# Altium project Newracom-WiWi.PrjPcb (part 3 of 3)

## Sheet POWER.SchDoc: POWER
size B; SheetNumber: 7; SheetTotal: 9
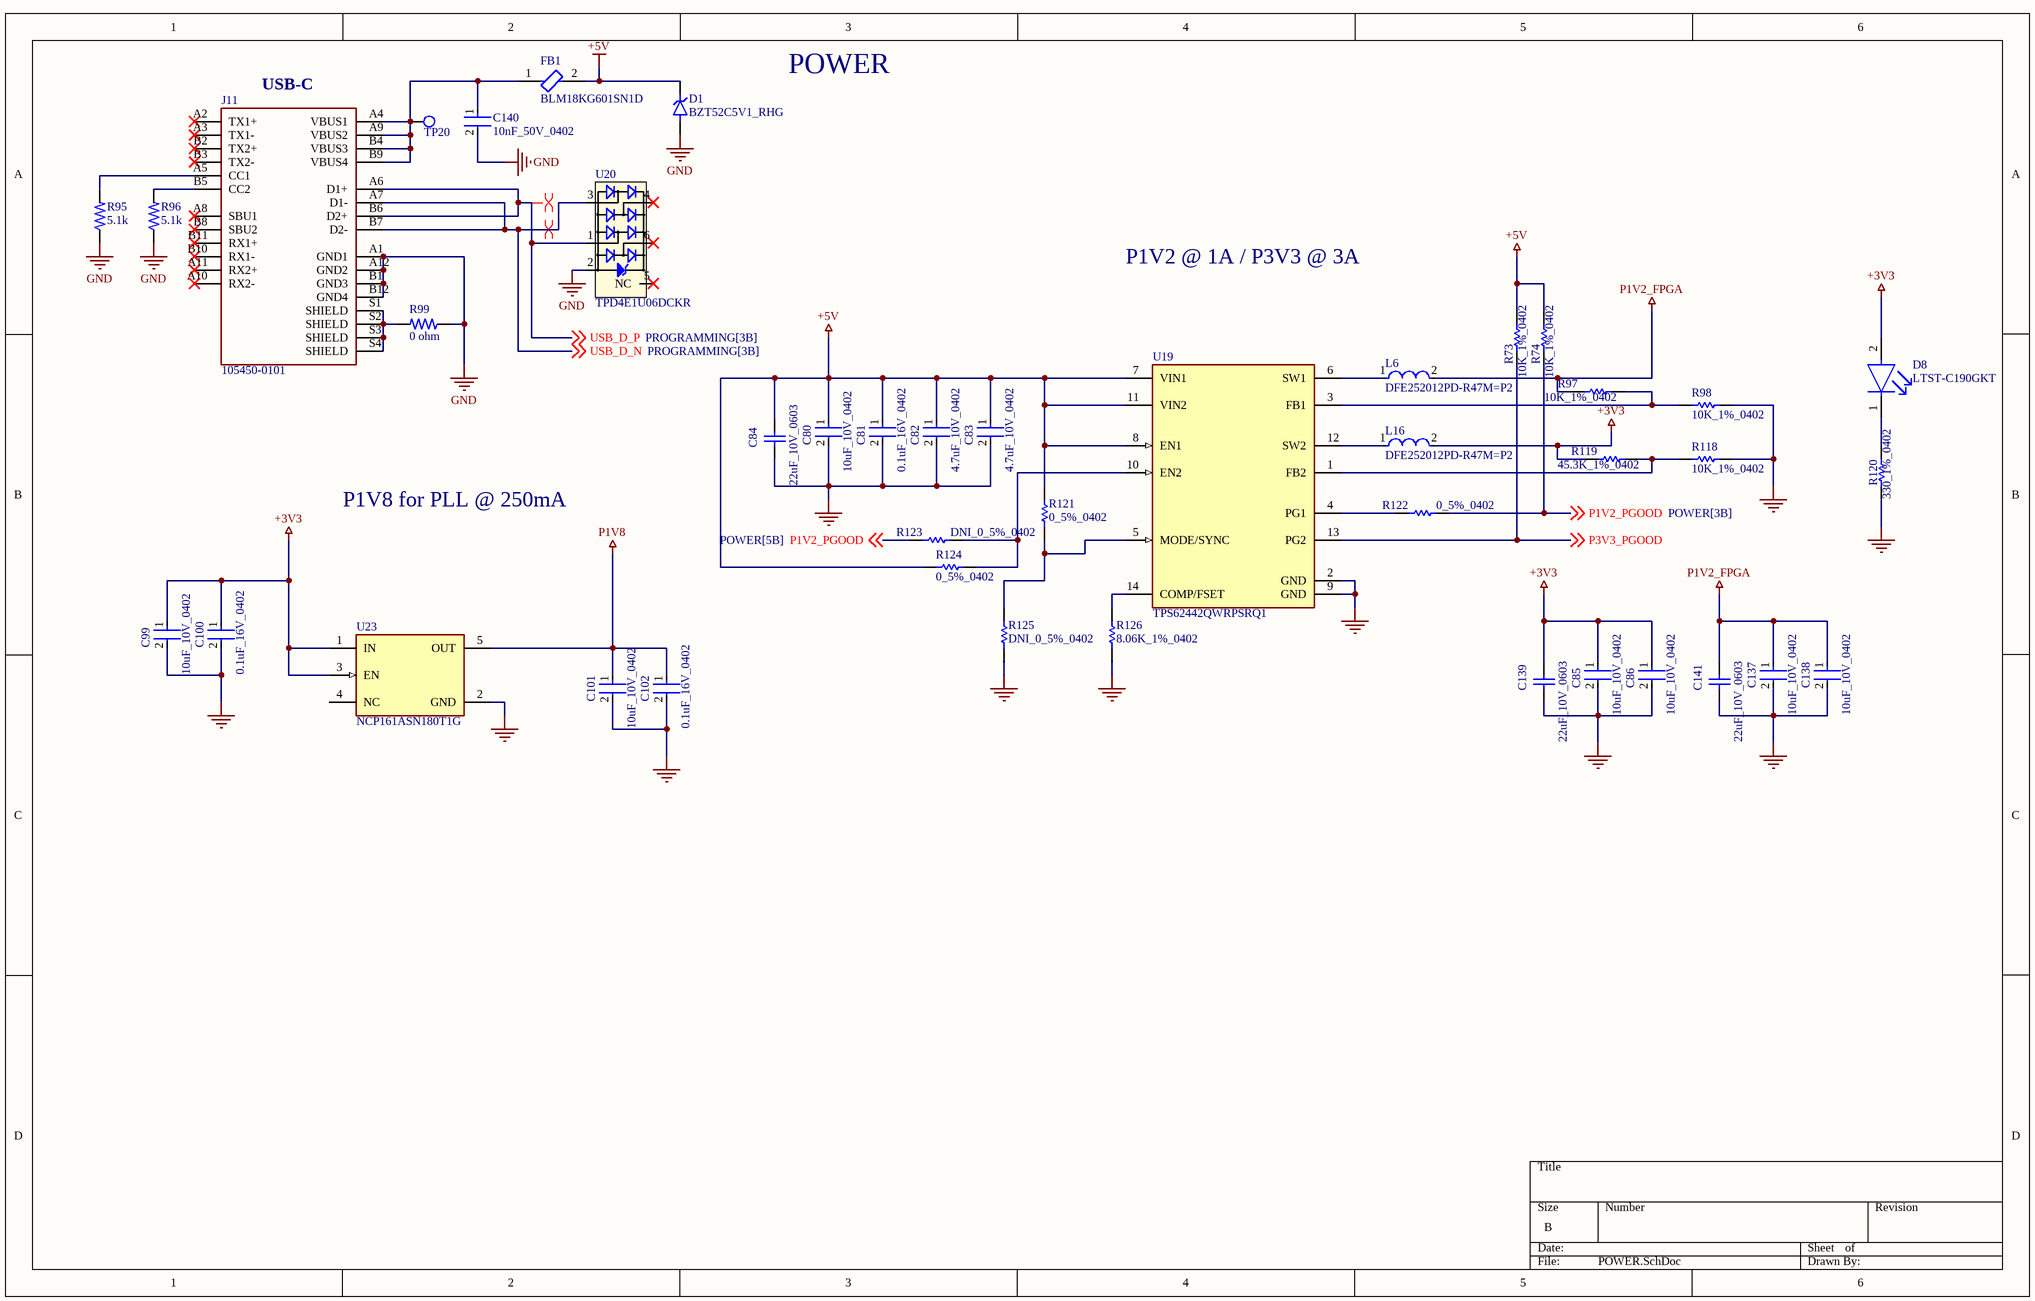
[diagram p7: POWER.SchDoc]

### Parts
C80  10uF_10V_0402  [FP-CL05A106MP5NUNC-MFG]
C81  0.1uF_16V_0402  [FP-C0402-BB-MFG]
C82  4.7uF_10V_0402  [FP-C1005-050-0_15-MFG]
C83  4.7uF_10V_0402  [FP-C1005-050-0_15-MFG]
C84  22uF_10V_0603  [CAPC1608X100X20ML10]
C85  10uF_10V_0402  [FP-CL05A106MP5NUNC-MFG]
C86  10uF_10V_0402  [FP-CL05A106MP5NUNC-MFG]
C99  10uF_10V_0402  [FP-CL05A106MP5NUNC-MFG]
C100  0.1uF_16V_0402  [FP-C0402-BB-MFG]
C101  10uF_10V_0402  [FP-CL05A106MP5NUNC-MFG]
C102  0.1uF_16V_0402  [FP-C0402-BB-MFG]
C137  10uF_10V_0402  [FP-CL05A106MP5NUNC-MFG]
C138  10uF_10V_0402  [FP-CL05A106MP5NUNC-MFG]
C139  22uF_10V_0603  [CAPC1608X100X20ML10]
C140  10nF_50V_0402  [FP-CL165-IPC_C]
C141  22uF_10V_0603  [CAPC1608X100X20ML10]
D1  BZT52C5V1_RHG  [D_BZT52C5V1_RHG]
D8  LTST-C190GKT  [FP-LTST-C190GKT-MFG]
FB1  BLM18KG601SN1D  [FP-BLM18-0_15-t0_8-IPC_A]
J11  105450-0101  [CONN_105450-0101]
L6  DFE252012PD-R47M=P2  [FP-DFE252012C-IPC_A]
L16  DFE252012PD-R47M=P2  [FP-DFE252012C-IPC_A]
R73  10K_1%_0402  [RESC1005X40X25NL10T10]
R74  10K_1%_0402  [RESC1005X40X25NL10T10]
R95  5.1k  [RES_0402]
R96  5.1k  [RES_0402]
R97  10K_1%_0402  [RESC1005X40X25NL10T10]
R98  10K_1%_0402  [RESC1005X40X25NL10T10]
R99  0 ohm  [RES_0402]
R118  10K_1%_0402  [RESC1005X40X25NL10T10]
R119  45.3K_1%_0402  [RESC0402(1005)_L]
R120  330_1%_0402  [RESC1005X40X25NL10T10]
R121  0_5%_0402  [RESC1005X40X25NL05T10]
R122  0_5%_0402  [RESC1005X40X25NL05T10]
R123  DNI_0_5%_0402  [RESC1005X40X25NL05T10]  (no BOM)
R124  0_5%_0402  [RESC1005X40X25NL05T10]
R125  DNI_0_5%_0402  [RESC1005X40X25NL05T10]  (no BOM)
R126  8.06K_1%_0402  [RESC1005X40X25ML05T05]
TP20  Test Point 1MM  [TP_PAD-1MM]  (value not drawn)  (no BOM)
U19  TPS62442QWRPSRQ1  [FP-RQR0014A-MFG]
U20  TPD4E1U06DCKR  [IC_TPD4E1U06DCKR]
U23  NCP161ASN180T1G  [FP-527AH-MFG]

### Nets
+3V3: C85.1 C86.1 C99.1 C100.1 C139.2 D8.2(A) L16.2 R119.1 U23.1(IN) U23.3(EN)
+5V: C80.1 C81.1 C82.1 C83.1 C84.2 D1.C(K) FB1.2 R73.2 R74.2 R121.2 R124.2 U19.7(VIN1) U19.8(EN1) U19.11(VIN2)
GND: C80.2 C81.2 C82.2 C83.2 C84.1 C85.2 C86.2 C99.2 C100.2 C101.2 C102.2 C137.2 C138.2 C139.1 C140.2 C141.1 D1.A J11.A1(GND1) J11.A12(GND2) J11.B1(GND3) J11.B12(GND4) R95.1 R96.1 R98.1 R99.1 R118.1 R120.1 R125.1 R126.1 U19.2(GND) U19.9(GND) U20.2(GND) U23.2(GND)
P1V2_FPGA: C137.1 C138.1 C141.2 L6.2 R97.2
P1V8: C101.1 C102.1 U23.5(OUT)
P1V2_PGOOD: R74.1 R122.2 R123.1 ; off-sheet P1V2_PGOOD
P3V3_PGOOD: R73.1 U19.13(PG2) ; off-sheet P3V3_PGOOD
USB_D_N: J11.A7(D1-) J11.B7(D2-) U20.3(D+) ; off-sheet USB_D_N
USB_D_P: J11.A6(D1+) J11.B6(D2+) U20.1(D+) ; off-sheet USB_D_P
NetC140_1: C140.1 FB1.1 J11.A4(VBUS1) J11.A9(VBUS2) J11.B4(VBUS3) J11.B9(VBUS4) TP20.1
NetD8_1: D8.1(C) R120.2
NetJ11_A5: J11.A5(CC1) R95.2
NetJ11_B5: J11.B5(CC2) R96.2
NetJ11_S1: J11.S1(SHIELD) J11.S2(SHIELD) J11.S3(SHIELD) J11.S4(SHIELD) R99.2
NetL6_1: L6.1 U19.6(SW1)
NetL16_1: L16.1 U19.12(SW2)
NetR97_1: R97.1 R98.2 U19.3(FB1)
NetR118_2: R118.2 R119.2 U19.1(FB2)
NetR121_1: R121.1 R125.2 U19.5(MODE/SYNC)
NetR122_1: R122.1 U19.4(PG1)
NetR123_2: R123.2 R124.1 U19.10(EN2)
NetR126_2: R126.2 U19.14(COMP/FSET)

Not connected (* = marked no-connect by the designer): J11 A2(TX1+)* A3(TX1-)* A8(SBU1)* A10(RX2-)* A11(RX2+)* B2(TX2+)* B3(TX2-)* B8(SBU2)* B10(RX1-)* B11(RX1+)*; U20 4(D-)* 5(NC)* 6(D-)*; U23 4(NC)

### Layout directives
differential pair: USB_D_N, USB_D_P

### Notes on the sheet
- (near J11) USB-C
- P1V2 @ 1A / P3V3 @ 3A
- P1V8 for PLL @ 250mA

### Library data of the parts
C80 C85 C86 C99 C101 C137 C138 = CMP-13271-000002-1: CAP CER 10UF 10V X5R 0402; Manufacturer Part Number: CL05A106MP5NUNC; Manufacturer: Samsung; Temperature Coefficient: 15%; Tolerance: 20%; Material: Ceramic; Octopart: https://octopart.com/cl05a106mp5nunc-samsung-22457395; Voltage Rating: 10V; RoHS: TRUE; Value: 10uF; Height: 0.7mm; Digikey Description: CAP CER 10UF 10V X5R 0402; Automotive: No; Package: CL05A106MP5NUNC; Device Class L1: Passive Components; Capacitance: 10uF; Temperature Range High: +85°C; ComponentLink2Description: Datasheet; Device Class L2: Capacitors; Temperature Characteristic: X5R; Temperature: -55°C to +85°C; ComponentLink2URL: http://www.samsungsem.com/kr/support/product-search/mlcc/__icsFiles/afieldfile/2019/05/10/19-CL05A106MP5NUNC.pdf; Device Class L3: Ceramic Capacitors; Category: Cap; Temperature Range Low: -55°C; Ipc Land Pattern Name: CAPC10050X50; Lead Free: Yes
C81 C100 C102 = CMP-1034-02068-3: CAP CER 0.1UF 16V 5% X7R 0402; Manufacturer: Kemet; Manufacturer Part Number: C0402C104J4RACTU; Value: 0.10 μF; Temperature Coefficient: 15%; Tolerance: 0.05; Material: Ceramic; ComponentLink2URL: https://content.kemet.com/datasheets/KEM_C1002_X7R_SMD.pdf; Automotive: No; Device Class L2: Capacitors; Temperature: -55°C to +125°C; RoHS: TRUE; Voltage Rating: 16 V; ComponentLink2Description: Datasheet; Device Class L3: Ceramic Capacitors; Temperature Range Low: -55°C; Ipc Land Pattern Name: CAPC10050X50; Device Class L1: Passive Components; Temperature Range High: +125°C; Package: C0402-BB; Capacitance: 0.10 μF; Category: Cap; Mouser Description: CAP CER 0.1UF 16V X7R 0402; Height: 0.55mm; Digikey Description: CAP CER 0.1UF 16V 5% X7R 0402; Octopart: https://octopart.com/c0402c104j4ractu-kemet-12573893; Temperature Characteristic: X7R; Lead Free: Yes
C82 C83 = CMP-2000-05997-2: CAP CER 4.7UF 10V X5R 0402; Dielectric Material: Ceramic; Tolerance: 10%; Series: C; Package Quantity: 10000; Max Operating Temperature: 85°C; Case Code (Imperial): 0402; Lead Free: Lead Free; Voltage Rating (DC): 10V; Packaging: Cut Tape; Voltage Rating: 10V; Min Operating Temperature: -55°C; Dielectric: X5R; Thickness: 0.022inch; Width: 0.02inch; Case/Package: 0402; Case Code (Metric): 1005; Capacitance: 4.7uF; Length: 0.039inch; RoHS Compliant: Yes; REACH SVHC: No SVHC; Mount: Surface Mount
C84 C139 C141 = CMP-2000-05441-1: Chip Capacitor, 22 uF, +/- 20%, 10 V, -55 to 85 degC, 0603 (1608 Metric), RoHS, Tape and Reel; Manufacturer: TDK; PCN Part Number: MLCCPartNumberChange30/Nov/2012; Voltage - Rated: 10V; Product Training Modules: CSeriesGeneralApplicationsSEAT,CCV,andTVCLDesignToolsGuidetoReplacinganElectrolyticCapacitorwithanMLCC; Other Names: 445-9077-1; Design Resources: 20WNon-IsolatedBuckLEDDriverUsingPLLNK460KG; Online Catalog: CSeries,GeneralPurpose; Capacitance: 22µF; Temperature Coefficient: X5R; Kits: 445-9014-KIT-ND-KITMLCC100PF-22UF060310-50V; Packaging: CutTape(CT); Standard Package: 1; Package / Case: 0603(1608Metric); Lead Style: -; Features: -; Ratings: -; Operating Temperature: -55degC~85degC; Applications: GeneralPurpose; Package Reference: 603; Datasheet URL: http://download.siliconexpert.com/pdfs/2015/4/21/15/54/45/779/tdk_/manual/37024850441143360mlcc_commercial_general_en.pdf; Datasheet Version: Mar-15; Mounting Type: SurfaceMount,MLCC; Lead Spacing: -; Size / Dimension: 0.063"Lx0.031"W(1.60mmx0.80mm); Height - Seated (Max): -; Package Description: 2-Pin Surface Mount Device, Body 1.6 x 0.8 mm; Manufacturer URL: http://www.tdk.com/; RoHS Information: RoHSCertificate-MLCC; Tolerance: ±20%; Series: C; Thickness (Max): 0.035"(0.90mm); Family: CeramicCapacitors; Category: Capacitors
C140 = CMP-13271-000387-1: Cap Ceramic 10nF 50V X7R ±10% SMD 0402 +125°C Paper T/R; Depth: 0.5mm; Length: 1mm; Lead Free: Lead Free; Case Code (Metric): 1005; Width: 0.02inch; Min Operating Temperature: -55°C; Thickness: 0.022inch; Package Quantity: 1; Mount: Surface Mount; Height: 0.5mm; Voltage: 50V; Material: Ceramic; Tolerance: 10%; Case Code (Imperial): 0402; Radiation Hardening: No; Case/Package: 0402; Max Operating Temperature: 125°C; Voltage Rating (DC): 50V; Contact Plating: Tin; Packaging: Tape and Reel; Voltage Rating: 50V; Capacitance: 10nF; Dielectric: X7R
D1 = D_BZT52C5V1_RHG: Vz=5.1V 4.8V~5.4V Izt=5mA; Manufacturer: Diodes; Manufacturer Part Number: BZT52C5V1-7-F; MP: BZT52C5V1 RHG; MF: Taiwan Semiconductor; Zener Voltage: 5.1V; Max Power Dissipation: 500mW; Impedance: 60R; Voltage Tolerance: 6%; Test Current: 5mA; Max Reverse Leakage Current: 2uA; Forward Voltage: 900mV; Output Current: 50mA; Availability: In Stock; SnapEDA_Link: https://www.snapeda.com/parts/BZT52C5V1%20RHG/Taiwan+Semiconductor/view-part/?ref=snap; Value: *; Price: None; Package: SOD-123F Taiwan Semiconductor; Purchase-URL: https://pricing.snapeda.com/search/part/BZT52C5V1 RHG/?ref=eda; Check_prices: https://www.snapeda.com/parts/BZT52C5V1%20RHG/Taiwan+Semiconductor/view-part/?ref=eda; Supplier 1: LCSC; RoHS: Yes; Category: Zener Diodes; Stock 1: 13380; Pricing 1: 20=0.0177, 200=0.0158, 600=0.0154, 3000=0.0137 (USD); Mounting Technology: Surface Mount; Pins: 2; Weight: 0.000353oz; Min Operating Temperature: -65°C; Max Operating Temperature: 150°C; Packaging: Tape and Reel; Package Quantity: 3000; Tolerance: 6%; Power Dissipation: 500mW; Series: -; Zener Current: 5mA; Power Rating: 500mW; Max Reverse Current: 2uA; Termination: SMD/SMT; Voltage Rating (DC): 5.1V; Working Voltage: 5.1V; Length: 2.85mm; Width: 1.7mm; Height: 1.35mm; Radiation Hardening: No; RoHS Compliant: Yes; Lead Free: Lead Free; Reach SVHC Compliant: No; ComponentLink1URL: https://datasheet.ciiva.com/15142/getdatasheetpartid-75143-15142417.pdf?src-supplier=Verical; ComponentLink1Description: https://datasheet.ciiva.com/15142/getdatasheetpartid-75143-15142417.pdf?src-supplier=Verical; ComponentLink2URL: https://datasheet.ciiva.com/4734/ds18004-73542-4734246.pdf?src-supplier=Mouser; ComponentLink2Description: https://datasheet.ciiva.com/4734/ds18004-73542-4734246.pdf?src-supplier=Mouser; ComponentLink3URL: https://datasheet.ciiva.com/22713/1670962-22713975.pdf?src-supplier=Element14; ComponentLink3Description: https://datasheet.ciiva.com/22713/1670962-22713975.pdf?src-supplier=Element14; Supplier Part Number 1: C151588
D8 = CMP-22017-000005-2: LED GREEN CLEAR CHIP SMD; Dominant Wavelength: 569nm; Reverse Voltage: 5V; Lens Color: Colorless; Viewing Angle: 130°; Voltage: 2V; Forward Current: 30mA; Power Dissipation: 100mW; Luminous Intensity: 6mcd; Number of LEDs: 1; Forward Voltage: 2.1V; Wavelength: 565nm; Test Current: 10mA; Min Operating Temperature: -55°C; Lens Style: Clear; Mount: Surface Mount; Width: 0.8mm; Packaging: Tape and Reel; Lens Transparency: Clear; Case Code (Metric): 1608; Depth: 0.8mm; Case Code (Imperial): 0603; Case/Package: 0603; Number of Pins: 2; Max Operating Temperature: 85°C; Lead Free: Lead Free; Number of Elements: 1; Length: 1.6mm; Height: 0.8mm; Package Quantity: 1; Power Rating: 100mW; Radiation Hardening: No; Illumination Color: Green; Color: Green
FB1 = CMP-0686-00581-3: Chip Ferrite Bead, 0603, 600Ω @ 100MHz, 0.15Ω, 25%, 1.3A; Material: Steel; Number of Lines: 1; Impedance: 600R; DC Resistance (DCR): 150mR; Tolerance: 25%; Case Code (Metric): 1608; Width: 0.8mm; DC Current: 1.3A; Max DC Current: 1.3A; Package Quantity: 1; Number of Pins: 2; Military Standard: Not; RoHS Compliant: Yes; Termination: SMD/SMT; Max Operating Temperature: 125°C; Length: 1.6mm; Depth: 0.8mm; Case Code (Imperial): 0603; Series: BLM18K; Inductor Type: FERRITE BEAD; Core Material: Ferrite; Number of Circuits: 1; Height: 0.8mm; Case/Package: 0603; REACH SVHC: No SVHC; Packaging: Tape and Reel; Min Operating Temperature: -55°C; Max Current Rating: 1.3A; Radiation Hardening: No; Current Rating: 1.3A; Lead Free: Lead Free; Test Frequency: 100MHz; Weight: 7.1E-05oz
J11 = CONN_105450-0101: USB-C (USB TYPE-C) USB 3.2 Gen 2 (USB 3.1 Gen 2, Superspeed + (USB 3.1)) Receptacle Connector 24 Position Surface Mount, Right Angle; Through Hole; MF: Molex; MP: 105450-0101; Availability: In Stock; Check_prices: https://www.snapeda.com/parts/105450-0101/Molex/view-part/?ref=eda; Price: None; SnapEDA_Link: https://www.snapeda.com/parts/105450-0101/Molex/view-part/?ref=snap; Purchase-URL: https://pricing.snapeda.com/search/part/105450-0101/?ref=eda; Package: None; Value: *
L6 L16 = CMP-06042-015149-1: Shielded Wirewound Inductor 0.47uH 20% 4000mA 0.027Ω 1008 (2520)
R73 R74 R97 R98 R118 = CMP-2002-04694-1: Manufacturer: Bourns; Part Number: CR0402-FX-1002GLF
R95 R96 = RES_RMCF0402FT5K10: Res Thick Film 0402 5.1K Ohm 1% 0.063W ±100ppm/°C Molded SMD Paper T/R; Manufacturer: Stackpole Electronics; Resistance: 5.1kR; Power Rating: 62.5mW; Max Power Dissipation: 63mW; Supplier 1: Digi-Key; Manufacturer Part Number: RMCF0402FT5K10; RoHS: Yes; Category: Chip SMD Resistors; Stock 1: 428257; Pricing 1: 1=0.10000, 10=0.01500, 100=0.00610, 1000=0.00274, 2500=0.00238, 5000=0.00197 (USD); Mount: Surface Mount; Case/Package: 0402; Case Code (Metric): 1005; Case Code (Imperial): 0402; Contact Plating: Tin,Matte; Min Operating Temperature: -55°C; Max Operating Temperature: 155°C; Packaging: Tape and Reel; Tolerance: 1%; Resistor Type: Thick Film; Number of Terminations: 2; Temperature Coefficient: 100ppm/°C; Features: Automotive AEC-Q200; Series: RMCF; Length: 0.039inch; Width: 0.02inch; Height: 0.016inch; Radiation Hardening: No; RoHS Compliant: Yes; ComponentLink1URL: http://components.arrow.com/part/dataview/51396875S385758N1174?src-supplier=Arrow+Electronics; ComponentLink1Description: http://components.arrow.com/part/dataview/51396875S385758N1174?src-supplier=Arrow+Electronics; ComponentLink2URL: https://www.seielect.com/catalog/SEI-RMCF_RMCP.pdf?src-supplier=Avnet; ComponentLink2Description: https://www.seielect.com/catalog/SEI-RMCF_RMCP.pdf?src-supplier=Avnet; ComponentLink3URL: https://www.seielect.com/catalog/SEI-Packaging.pdf?src-supplier=Digi-Key; ComponentLink3Description: https://www.seielect.com/catalog/SEI-Packaging.pdf?src-supplier=Digi-Key; ComponentLink4URL: https://www.seielect.com/catalog/SEI-RMCF_RMCP.pdf?src-supplier=Avnet+Asia; ComponentLink4Description: https://www.seielect.com/catalog/SEI-RMCF_RMCP.pdf?src-supplier=Avnet+Asia; Supplier Part Number 1: RMCF0402FT5K10CT-ND
R99 = RES_RC0402JR-070RL: RES SMD 0 OHM JUMPER 1/16W 0402; Manufacturer: Yageo; Value: 0mR; Power Rating: 62.5mW; Tolerance: 5%; Voltage Rating: 50V; Max Power Dissipation: 63mW; Temperature Coefficient: 200ppm/°C; Supplier 1: Digi-Key; Manufacturer Part Number: RC0402JR-070RL; RoHS: Yes; Category: Chip SMD Resistors; Stock 1: 33185339; Pricing 1: 1=0.10000, 10=0.01200, 25=0.00840, 50=0.00640, 100=0.00480, 250=0.00364, 500=0.00290, 1000=0.00214, 5000=0.00154 (USD); Case/Package: 0402; Case Code (Metric): 1005; Case Code (Imperial): 0402; Contact Plating: Tin,Matte; Min Operating Temperature: -55°C; Max Operating Temperature: 155°C; Package Quantity: 1; Packaging: Tape and Reel; Resistor Type: Thick Film; Number of Terminations: 2; Termination: SMD/SMT; Features: Moisture Resistant; Series: RC; Technology: THICK FILM; Resistance Tolerance: 5%; Construction: Rectangular; Length: 1mm; Width: 0.02inch; Height: 0.016inch; Depth: 0.5mm; Radiation Hardening: No; Military Standard: Not; Lead Free: Lead Free; RoHS Compliant: Yes; ComponentLink1URL: https://datasheet.ciiva.com/2452/pyu-rc0402-51-rohs-l-6-2452608.pdf?src-supplier=Digi-Key; ComponentLink1Description: https://datasheet.ciiva.com/2452/pyu-rc0402-51-rohs-l-6-2452608.pdf?src-supplier=Digi-Key; ComponentLink2URL: https://datasheet.ciiva.com/7983/1018594-7983535.pdf?src-supplier=Element14; ComponentLink2Description: https://datasheet.ciiva.com/7983/1018594-7983535.pdf?src-supplier=Element14; ComponentLink3URL: https://datasheet.ciiva.com/22747/1018594-22747515.pdf?src-supplier=Element14; ComponentLink3Description: https://datasheet.ciiva.com/22747/1018594-22747515.pdf?src-supplier=Element14; ComponentLink4URL: https://datasheet.ciiva.com/2452/pyu-r-int-thick-7-2452609.pdf?src-supplier=Digi-Key; ComponentLink4Description: https://datasheet.ciiva.com/2452/pyu-r-int-thick-7-2452609.pdf?src-supplier=Digi-Key; ComponentLink5URL: https://datasheet.ciiva.com/2452/pyu-r-int-thick-7-2452610.pdf?src-supplier=Digi-Key; ComponentLink5Description: https://datasheet.ciiva.com/2452/pyu-r-int-thick-7-2452610.pdf?src-supplier=Digi-Key; ComponentLink6URL: https://datasheet.ciiva.com/8896/pyu-rc0402-51-rohs-l-6-8896201.pdf?src-supplier=Avnet; ComponentLink6Description: https://datasheet.ciiva.com/8896/pyu-rc0402-51-rohs-l-6-8896201.pdf?src-supplier=Avnet; ComponentLink7URL: https://datasheet.ciiva.com/15189/getdatasheetpartid-326379-15189533.pdf?src-supplier=Verical; ComponentLink7Description: https://datasheet.ciiva.com/15189/getdatasheetpartid-326379-15189533.pdf?src-supplier=Verical; Supplier Part Number 1: 311-0.0JRCT-ND
R119 = CMP-1011-00697-1: 45K3 0.063W 1% 0402 (1005 Metric)  SMD; Case-EIA: 0402; Case-Metric: 1005; Value: 45300.00 Ohm; Technology: SMT; Tolerance: 1 %; Power: 0.063 W
R120 = CMP-2002-05853-1: Manufacturer: Panasonic; Part Number: ERA-2AED331X
R121-R125 = CMP-2002-06457-1: Manufacturer: Panasonic; Part Number: ERJ-U020R00X
R126 = CMP-2002-00253-3: Chip Resistor, 8.06 KOhm, +/- 1%, 63 mW, -55 to 155 degC, 0402 (1005 Metric), RoHS, Tape and Reel; PartNumber: CRCW04028K06FKED; Manufacturer: Basic Passives; Case\/Package: 0402; Power Rating: 63 mW; Voltage Rating: 50 V; PackageReference: 0402; Radiation Hardening: No; Package Quantity: 10000; Height: 0.35 mm; Packaging: Tape and Reel; Mount: Surface Mount; Length: 1 mm; Weight: 2.3E-05oz; Case Code (Metric): 1005; DatasheetVersion: 06/2012; Pins: 2; Min Operating Temperature: -55 degC; Case Code (Imperial): 0402; REACH SVHC: Unknown; Tolerance: 1%; Mounting Technology: Surface Mount; ComponentLink1URL: http://www.vishay.com/; ComponentLink2URL: http://www.vishay.com/docs/20035/dcrcwe3.pdf; ComponentLink2Description: Datasheet; Resistance: 8.06 KOhm; Max Operating Temperature: 155 degC; ComponentLink1Description: Manufacturer URL; Width: 0.5 mm; RoHSCompliant: true; PackageDescription: 2-Pin Surface Mount Device, Body 1 x 0.5 mm
TP20 = TP_PAD-1MM
U19 = CMP-04918-000654-1: Adjustable-Frequency Dual Step-Down Converter, 2.7-6V VIN, 0.6-5.5V 2A VOUT, VQFN-HR14
U20 = IC_TPD4E1U06DCKR: TVS DIODE 5.5VWM 15VC SC70-6; Manufacturer: Texas Instruments; Direction: Unidirectional; Value: 1pF; Operating Supply Voltage: 5.5V; Min Breakdown Voltage: 6.5V; Clamping Voltage: 11V; Peak Pulse Power: 45W; Power Line Protection: Yes; Number of Channels: 4; Test Current: 1mA; Max Reverse Leakage Current: 10nA; Peak Pulse Current: 3A; Interface: LVDS,USB,Ethernet; Supplier 1: LCSC; Manufacturer Part Number: TPD4E1U06DCKR; RoHS: Yes; Category: Integrated Circuits (ICs); Stock 1: 448671; Pricing 1: 1=0.1276, 10=0.0987, 30=0.0864, 100=0.0709, 500=0.064, 1000=0.0478 (USD); Mounting Technology: Surface Mount; Case/Package: SC; Pins: 6; Min Operating Temperature: -40°C; Max Operating Temperature: 125°C; Package Quantity: 3000; Packaging: Tape and Reel; Reverse Standoff Voltage: 5.5V; Breakdown Voltage: 6.5V; Termination: SMD/SMT; ESD Protection: Yes; Working Voltage: 5.5V; Max Power Dissipation: 45W; Series: -; Number of Unidirectional Channels: 4; Length: 2.15mm; Width: 1.4mm; Height: 1mm; Reach SVHC Compliant: No; Lead Free: Lead Free; RoHS Compliant: Yes; ComponentLink1URL: https://datasheet.ciiva.com/12545/tpd4e1u06-224689-12545136.pdf?src-supplier=Mouser; ComponentLink1Description: https://datasheet.ciiva.com/12545/tpd4e1u06-224689-12545136.pdf?src-supplier=Mouser; ComponentLink2URL: https://datasheet.ciiva.com/6574/tpd4e1u06-6574672.pdf?src-supplier=Digi-Key; ComponentLink2Description: https://datasheet.ciiva.com/6574/tpd4e1u06-6574672.pdf?src-supplier=Digi-Key; Supplier Part Number 1: C194628
U23 = CMP-00278-92192183-1: NCP161ASN180T1G LDO Regulator, 450 mA, Ultra-High PSRR, Ultra-Low Noise 1.8V, SOT23-5L, Active Discharge; Nominal Supply Current: 18µA; Output Type: Fixed; Number of Outputs: 1; Accuracy: 2%; Max Supply Voltage: 5.5V; Dropout Voltage: 365mV; Min Supply Voltage: 2.8V; Max Junction Temperature (Tj): 150°C; Output Current: 450mA; Output Voltage: 1.8V; Schedule B: 8542390000; Lifecycle Status: Production; NexarPartId: 92192183; Height: 1.45mm; Case/Package: SOT-23-5; RoHS: Compliant; Number of Channels: 1; Max Operating Temperature: 150°C; Manufacturer Lifecycle Status: ACTIVE

## Sheet DCTCXO.SchDoc: DCTCXO
size B; SheetNumber: 8; SheetTotal: 9
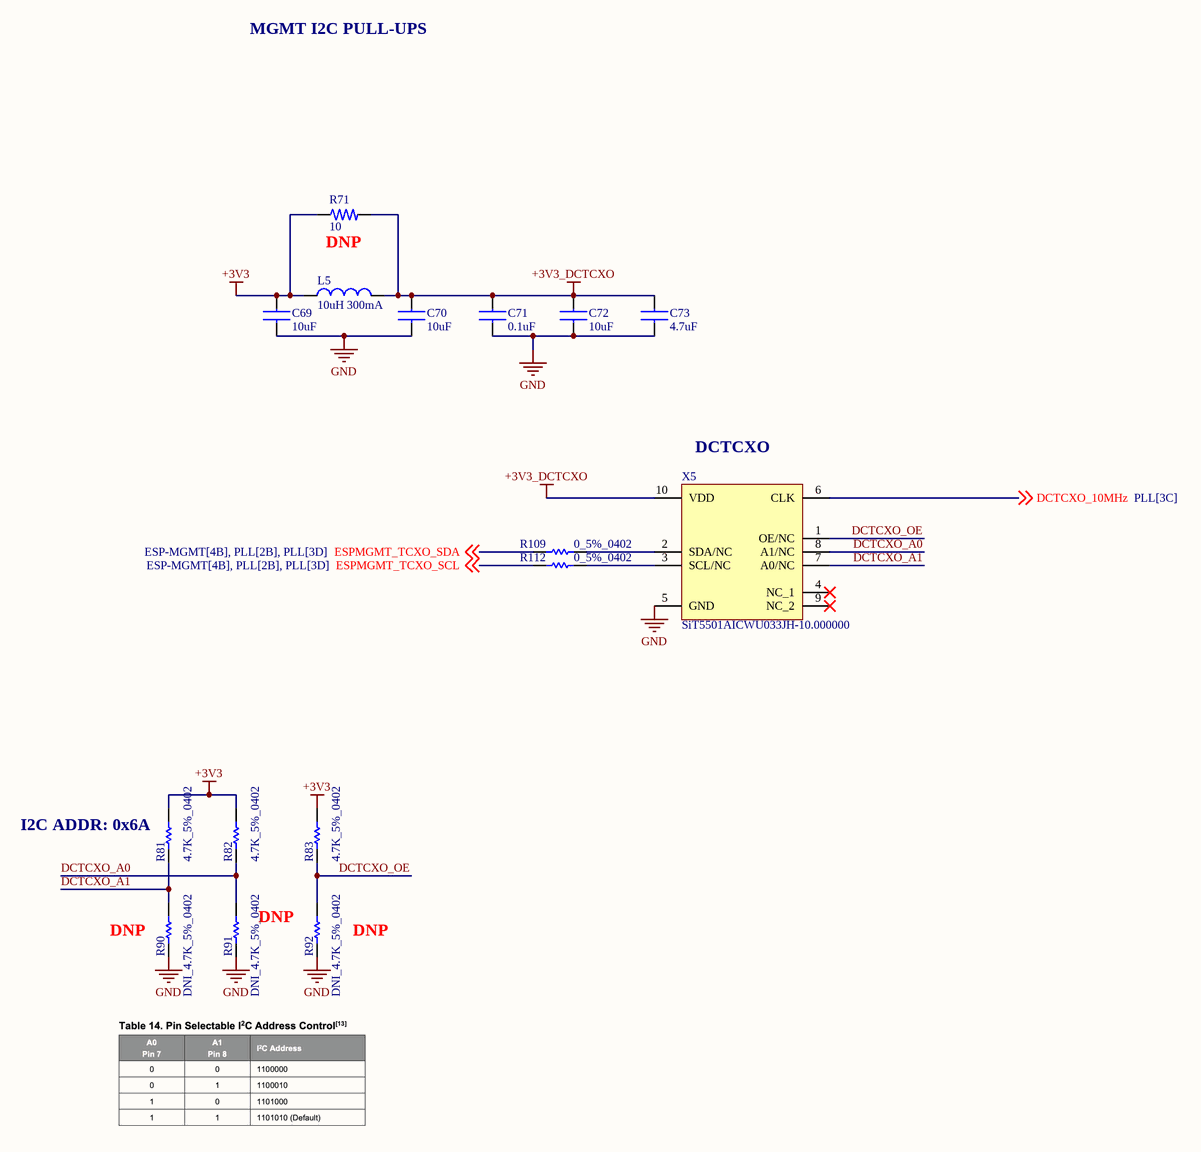
[diagram p8: DCTCXO.SchDoc]

### Parts
C69  10uF  [CAP_0402]
C70  10uF  [CAP_0402]
C71  0.1uF  [CAP_0402]
C72  10uF  [CAP_0402]
C73  4.7uF  [CAP_0402]
L5  10uH 300mA  [L_490-LQM18DN100M70LCT-ND]
R71  10  [RES_0402]  (no BOM)
R81  4.7K_5%_0402  [RESC1005X40X25LL05T05]
R82  4.7K_5%_0402  [RESC1005X40X25LL05T05]
R83  4.7K_5%_0402  [RESC1005X40X25LL05T05]
R90  DNI_4.7K_5%_0402  [RESC1005X40X25LL05T05]  (no BOM)
R91  DNI_4.7K_5%_0402  [RESC1005X40X25LL05T05]  (no BOM)
R92  DNI_4.7K_5%_0402  [RESC1005X40X25LL05T05]  (no BOM)
R109  0_5%_0402  [RESC1005X40X25ML05T10]
R112  0_5%_0402  [RESC1005X40X25ML05T10]
X5  SiT5501AICWU033JH-10.000000  [XTAL_SiT5501_70x50]

### Nets
+3V3: C69.2 L5.1 R71.1 R81.2 R82.2 R83.2
+3V3_DCTCXO: C70.2 C71.2 C72.2 C73.2 L5.2 R71.2 X5.10(VDD)
GND: C69.1 C70.1 C71.1 C72.1 C73.1 R90.1 R91.1 R92.1 X5.5(GND)
DCTCXO_10MHz: X5.6(CLK) ; off-sheet DCTCXO_10MHz
DCTCXO_A0: R82.1 R91.2 X5.8(A1/NC)
DCTCXO_A1: R81.1 R90.2 X5.7(A0/NC)
DCTCXO_OE: R83.1 R92.2 X5.1(OE/NC)
ESPMGMT_TCXO_SCL: R112.1 ; off-sheet ESPMGMT_TCXO_SCL
ESPMGMT_TCXO_SDA: R109.1 ; off-sheet ESPMGMT_TCXO_SDA
NetR109_2: R109.2 X5.2(SDA/NC)
NetR112_2: R112.2 X5.3(SCL/NC)

Not connected (* = marked no-connect by the designer): X5 4(NC_1)* 9(NC_2)*

### Notes on the sheet
- MGMT I2C PULL-UPS
- (near R71) DNP
- (near X5) DCTCXO
- (near R81) I2C ADDR: 0x6A
- (near R90) DNP
- DNP
- (near R92) DNP

### Library data of the parts
C69 C70 C72 = CAP_CL05A106MQ5NUNC: Cap Ceramic 10uF 6.3V X5R 20% SMD 0402 85°C Paper T/R; Manufacturer: Samsung; Supplier 1: Digi-Key; Manufacturer Part Number: CL05A106MQ5NUNC; RoHS: Yes; Category: Ceramic Capacitors; Stock 1: 3345553; Pricing 1: 1=0.27000, 10=0.18400, 50=0.11020, 100=0.09300, 500=0.06362, 1000=0.05629, 2500=0.05384, 5000=0.04894 (USD); Mount: Surface Mount; Case/Package: 0402; Case Code (Metric): 1005; Case Code (Imperial): 0402; Min Operating Temperature: -55°C; Max Operating Temperature: 85°C; Tolerance: 20%; Capacitance: 10uF; Dielectric: X5R; Packaging: Tape and Reel; Package Quantity: 1; Voltage Rating: 6.3V; Series: CL; Construction: Flat; Length: 1mm; Width: 0.02inch; Height: 0.5mm; Thickness: 0.028inch; Depth: 0.5mm; Radiation Hardening: No; ComponentLink1URL: https://datasheet.ciiva.com/16437/cl05a106mq5nunc-16437356.pdf?src-supplier=Future+Electronics; ComponentLink1Description: https://datasheet.ciiva.com/16437/cl05a106mq5nunc-16437356.pdf?src-supplier=Future+Electronics; ComponentLink2URL: https://datasheet.ciiva.com/26877/getdatasheetpartid-355289-26877841.pdf?src-supplier=Verical; ComponentLink2Description: https://datasheet.ciiva.com/26877/getdatasheetpartid-355289-26877841.pdf?src-supplier=Verical; Supplier Part Number 1: 1276-1451-1-ND
C71 = CAP_GCM155R71C104KA55J: Cap Ceramic 0.1uF 16V X7R 10% SMD 0402 125C Paper T/R; Manufacturer: Murata; Capacitance: 100nF; Supplier 1: Digi-Key; Manufacturer Part Number: GCM155R71C104KA55J; RoHS: Yes; Category: Ceramic Capacitors; Stock 1: 10738061; Pricing 1: 1=0.10000, 10=0.03500, 50=0.01920, 100=0.01560, 500=0.01116, 1000=0.00877, 2500=0.00798, 5000=0.00734 (USD); Mount: Surface Mount; Case/Package: 0402; Case Code (Imperial): 0402; Case Code (Metric): 1005; Min Operating Temperature: -55°C; Max Operating Temperature: 125°C; Tolerance: 10%; Voltage Rating: 16V; Voltage Rating (DC): 16V; Packaging: Tape and Reel; Package Quantity: 1; Dielectric: X7R; Termination: SMD/SMT; Series: GCM; Construction: Flat; Length: 1mm; Width: 0.5mm; Height: 0.5mm; Thickness: 0.022inch; Depth: 0.5mm; Ratings: AEC-Q200; Radiation Hardening: No; Lead Free: Lead Free; ComponentLink1URL: https://datasheet.ciiva.com/11618/product-11618848.pdf?src-supplier=Avnet; ComponentLink1Description: https://datasheet.ciiva.com/11618/product-11618848.pdf?src-supplier=Avnet; ComponentLink2URL: https://datasheet.ciiva.com/16440/gcm155r71c104ka55j-16440393.pdf?src-supplier=Future+Electronics; ComponentLink2Description: https://datasheet.ciiva.com/16440/gcm155r71c104ka55j-16440393.pdf?src-supplier=Future+Electronics; ComponentLink3URL: https://datasheet.ciiva.com/29542/product-29542474.pdf?src-supplier=Digi-Key; ComponentLink3Description: https://datasheet.ciiva.com/29542/product-29542474.pdf?src-supplier=Digi-Key; ComponentLink4URL: https://datasheet.ciiva.com/29542/product-29542475.pdf?src-supplier=Digi-Key; ComponentLink4Description: https://datasheet.ciiva.com/29542/product-29542475.pdf?src-supplier=Digi-Key; Supplier Part Number 1: 490-7998-1-ND
C73 = CAP_LMK105BBJ475MVLF: Multilayer Ceramic Capacitors MLCC - SMD/SMT 4.7uF 10V X5R +/-20% 0402 Gen Purp; Manufacturer: Taiyo Yuden; Tolerance: 20%; Supplier 1: Digi-Key; Manufacturer Part Number: LMK105BBJ475MVLF; RoHS: Yes; Category: Ceramic Capacitors; Pricing 1: 1=0.21000, 10=0.14400, 50=0.08640, 100=0.07300, 500=0.04994, 1000=0.04417, 2500=0.04225, 5000=0.03841 (USD); Mount: Surface Mount; Case/Package: 0402; Case Code (Metric): 1005; Case Code (Imperial): 0402; Weight: 2.3E-05oz; Min Operating Temperature: -55°C; Max Operating Temperature: 85°C; Capacitance: 4.7uF; Package Quantity: 10000; Packaging: Tape and Reel; Voltage Rating: 10V; Voltage Rating (DC): 10V; Dielectric: X5R; Termination: SMD/SMT; Resistor Type: Ceramic; Length: 1mm; Width: 0.02inch; Height: 0.5mm; Thickness: 0.022inch; Halogen Free: Halogen Free; RoHS Compliant: Yes; ComponentLink1URL: https://datasheet.ciiva.com/24462/423lmk105bbj475mvlf-24462535.pdf?src-supplier=Onlinecomponents.com; ComponentLink1Description: https://datasheet.ciiva.com/24462/423lmk105bbj475mvlf-24462535.pdf?src-supplier=Onlinecomponents.com; ComponentLink2URL: https://datasheet.ciiva.com/18697/mlcc-all-e-18697686.pdf?src-supplier=Digi-Key; ComponentLink2Description: https://datasheet.ciiva.com/18697/mlcc-all-e-18697686.pdf?src-supplier=Digi-Key; ComponentLink3URL: https://datasheet.ciiva.com/18697/mlcc-all-e-18697685.pdf?src-supplier=Digi-Key; ComponentLink3Description: https://datasheet.ciiva.com/18697/mlcc-all-e-18697685.pdf?src-supplier=Digi-Key; Supplier Part Number 1: 587-3408-1-ND
L5 = L_LQM18DN100M70L: Inductor, 10Uh, 0.3A, Multilayer Rohs Compliant: Yes; Manufacturer: Murata; Supplier 1: Digi-Key; Manufacturer Part Number: LQM18DN100M70L; RoHS: Yes; Category: Fixed Inductors; Stock 1: 236207; Pricing 1: 1=0.12000, 10=0.10500, 25=0.09280, 50=0.07900, 100=0.06970, 250=0.06388, 500=0.05808, 1000=0.04878 (USD); Supplier Part Number 1: 490-LQM18DN100M70LCT-ND
R71 = RES_RC0402FR-0710RL: Res General Purpose Thick Film 0402 10 Ohm 1% 1/16W ±200ppm/°C Molded SMD Paper T/R; Manufacturer: Yageo; Power Rating: 62.5mW; Voltage Rating: 50V; Value: 10R; Max Power Dissipation: 63mW; Supplier 1: Digi-Key; Manufacturer Part Number: RC0402FR-0710RL; RoHS: Yes; Category: Chip SMD Resistors; Stock 1: 6576941; Pricing 1: 1=0.10000, 10=0.02200, 100=0.00880, 1000=0.00396, 2500=0.00344, 5000=0.00284 (USD); Case/Package: 0402; Case Code (Imperial): 0402; Case Code (Metric): 1005; Min Operating Temperature: -55°C; Max Operating Temperature: 155°C; Tolerance: 1%; Packaging: Tape and Reel; Termination: SMD/SMT; Resistor Type: Thick Film; Temperature Coefficient: 200ppm/°C; Number of Terminations: 2; Features: Moisture Resistant; Series: RC; Resistance Tolerance: 1%; Technology: THICK FILM; Construction: Rectangular; Working Voltage: 50V; Length: 1mm; Height: 0.32mm; Depth: 0.5mm; Military Standard: Not; Lead Free: Lead Free; RoHS Compliant: Yes; Reach SVHC Compliant: Yes; ComponentLink1URL: https://datasheet.ciiva.com/46394/1018594-46394954.pdf?src-supplier=Element14; ComponentLink1Description: https://datasheet.ciiva.com/46394/1018594-46394954.pdf?src-supplier=Element14; ComponentLink2URL: https://datasheet.ciiva.com/7849/1018594-7849818.pdf?src-supplier=Element14; ComponentLink2Description: https://datasheet.ciiva.com/7849/1018594-7849818.pdf?src-supplier=Element14; ComponentLink3URL: https://datasheet.ciiva.com/7849/1018594-7849819.pdf?src-supplier=Element14; ComponentLink3Description: https://datasheet.ciiva.com/7849/1018594-7849819.pdf?src-supplier=Element14; ComponentLink4URL: https://datasheet.ciiva.com/15189/getdatasheetpartid-323697-15189339.pdf?src-supplier=Verical; ComponentLink4Description: https://datasheet.ciiva.com/15189/getdatasheetpartid-323697-15189339.pdf?src-supplier=Verical; Supplier Part Number 1: 311-10.0LRCT-ND
R81-R83 R90-R92 = CMP-1011-00090-2: Part Number: CRCW04024K70JNTD; Manufacturer: Vishay Dale
R109 R112 = CMP-2002-06457-1: as R121 on sheet POWER
X5 = XTAL_SIT5501AI-WUG33JT-10.000000: 1 MHz  60 MHz, Elite X Stratum 3E Precision Oscillator; Manufacturer_Name: SiTime; Manufacturer_Part_Number: SiT5501AI-WU033JH-10.000000; Geometry.Height: 2.2mm; Mouser Part Number: *; Mouser Price/Stock: *; Arrow Part Number: *; Arrow Price/Stock: *; Mouser Testing Part Number: *; Mouser Testing Price/Stock: *; Datasheet Link: https://www.sitime.com/support/resource-library/datasheets/sit5501-datasheet

## Sheet PLL.SchDoc
size B; SheetNumber: 9; SheetTotal: 9
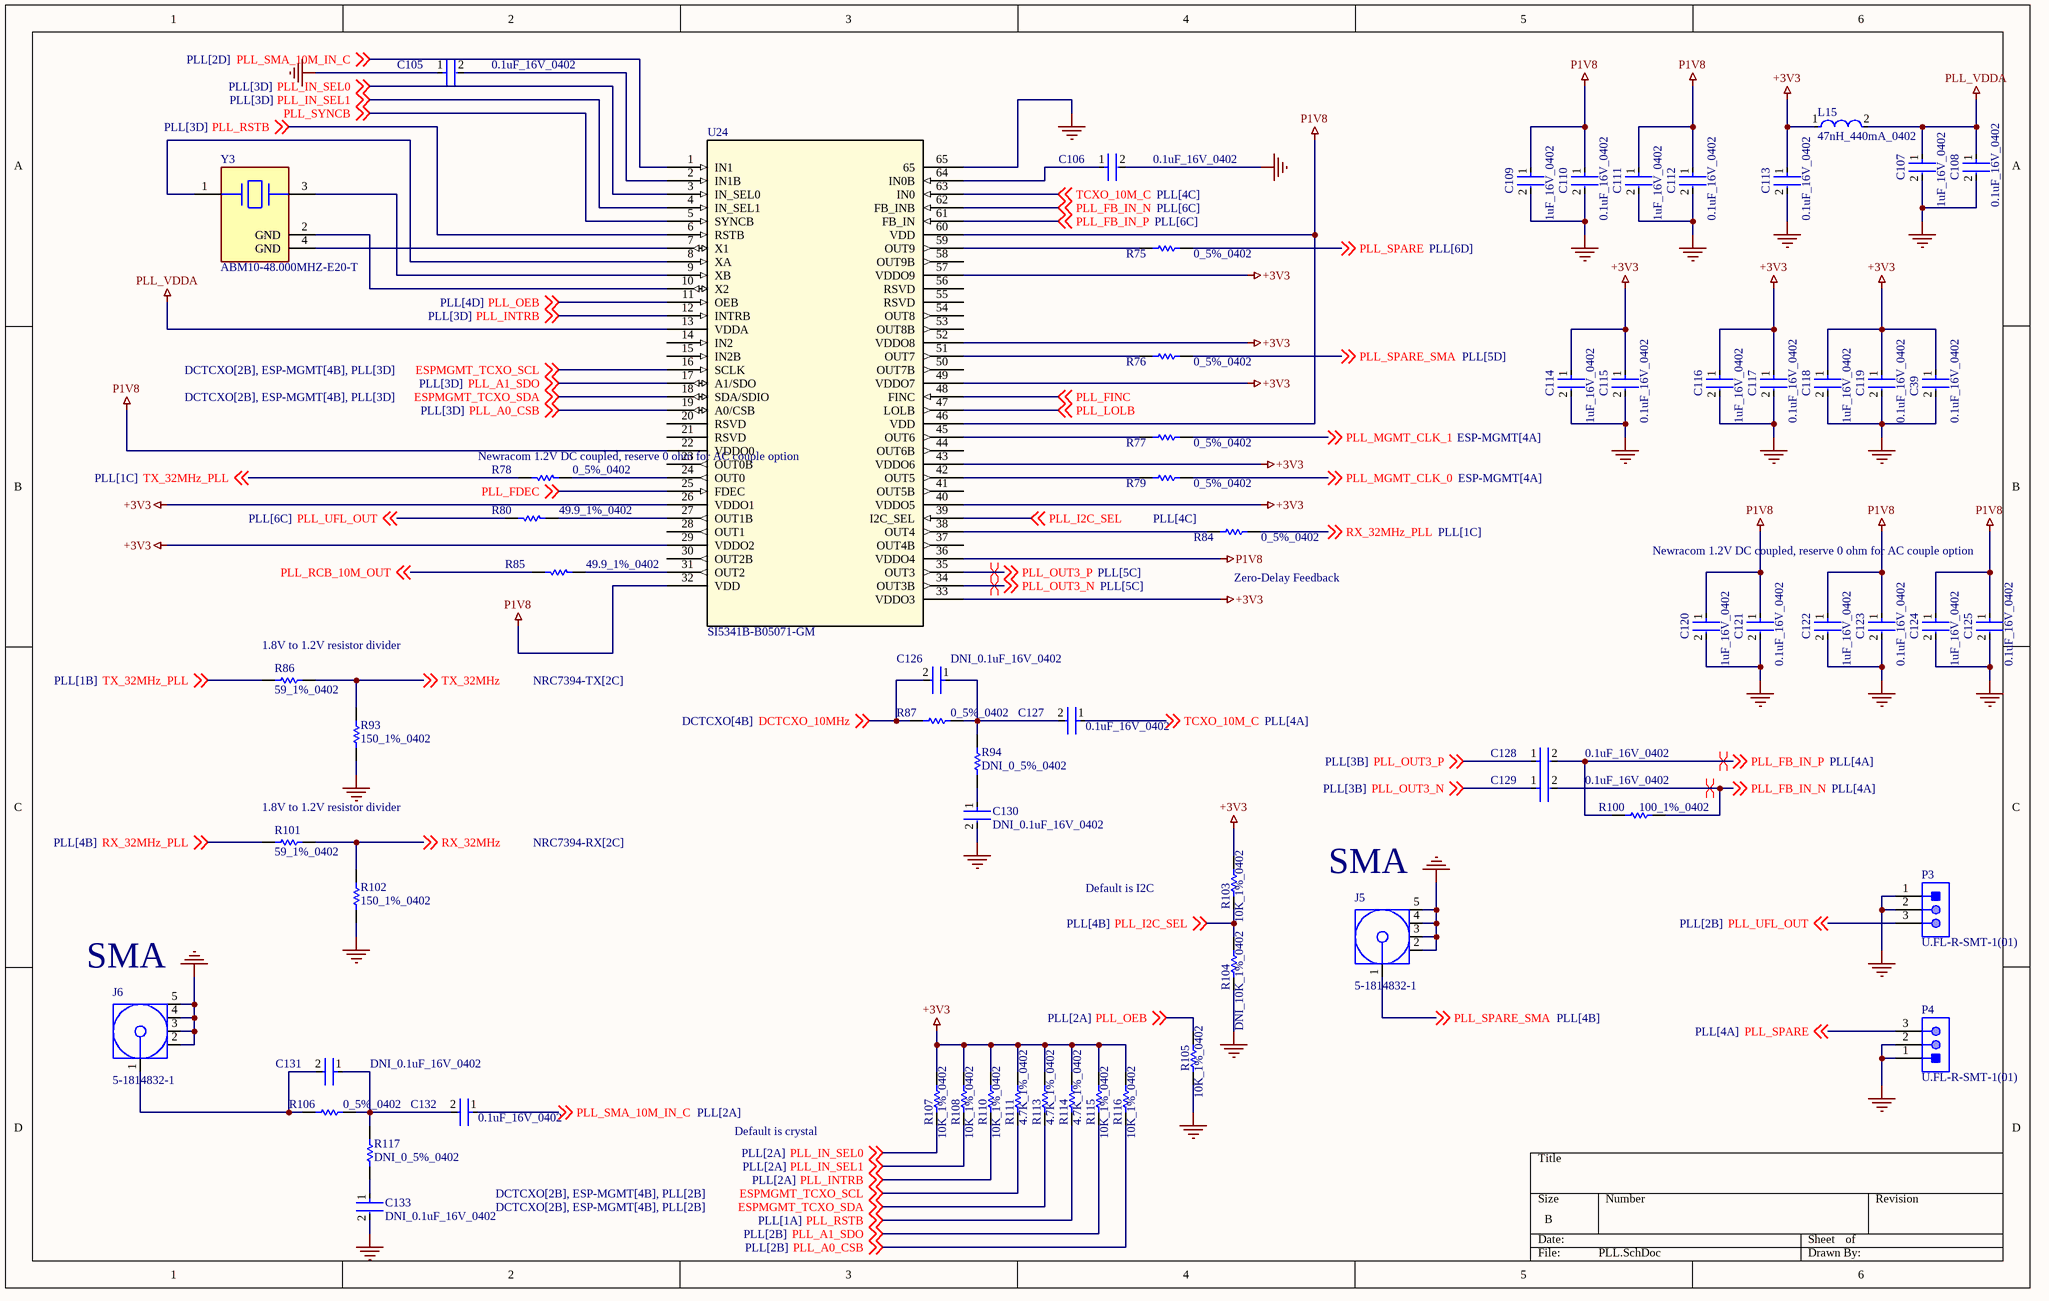
[diagram p9: PLL.SchDoc]

### Parts
C39  0.1uF_16V_0402  [FP-C0402-BB-MFG]
C105  0.1uF_16V_0402  [FP-C0402-BB-MFG]
C106  0.1uF_16V_0402  [FP-C0402-BB-MFG]
C107  1uF_16V_0402  [FP-0402-L_1_0_0_05-W_0_5-IPC_A]
C108  0.1uF_16V_0402  [FP-C0402-BB-MFG]
C109  1uF_16V_0402  [FP-0402-L_1_0_0_05-W_0_5-IPC_A]
C110  0.1uF_16V_0402  [FP-C0402-BB-MFG]
C111  1uF_16V_0402  [FP-0402-L_1_0_0_05-W_0_5-IPC_A]
C112  0.1uF_16V_0402  [FP-C0402-BB-MFG]
C113  0.1uF_16V_0402  [FP-C0402-BB-MFG]
C114  1uF_16V_0402  [FP-0402-L_1_0_0_05-W_0_5-IPC_A]
C115  0.1uF_16V_0402  [FP-C0402-BB-MFG]
C116  1uF_16V_0402  [FP-0402-L_1_0_0_05-W_0_5-IPC_A]
C117  0.1uF_16V_0402  [FP-C0402-BB-MFG]
C118  1uF_16V_0402  [FP-0402-L_1_0_0_05-W_0_5-IPC_A]
C119  0.1uF_16V_0402  [FP-C0402-BB-MFG]
C120  1uF_16V_0402  [FP-0402-L_1_0_0_05-W_0_5-IPC_A]
C121  0.1uF_16V_0402  [FP-C0402-BB-MFG]
C122  1uF_16V_0402  [FP-0402-L_1_0_0_05-W_0_5-IPC_A]
C123  0.1uF_16V_0402  [FP-C0402-BB-MFG]
C124  1uF_16V_0402  [FP-0402-L_1_0_0_05-W_0_5-IPC_A]
C125  0.1uF_16V_0402  [FP-C0402-BB-MFG]
C126  DNI_0.1uF_16V_0402  [FP-C0402-BB-MFG]  (no BOM)
C127  0.1uF_16V_0402  [FP-C0402-BB-MFG]
C128  0.1uF_16V_0402  [FP-C0402-BB-MFG]
C129  0.1uF_16V_0402  [FP-C0402-BB-MFG]
C130  DNI_0.1uF_16V_0402  [FP-C0402-BB-MFG]  (no BOM)
C131  DNI_0.1uF_16V_0402  [FP-C0402-BB-MFG]  (no BOM)
C132  0.1uF_16V_0402  [FP-C0402-BB-MFG]
C133  DNI_0.1uF_16V_0402  [FP-C0402-BB-MFG]  (no BOM)
J5  5-1814832-1  [TECO-5-1814832-1_V]
J6  5-1814832-1  [TECO-5-1814832-1_V]
L15  47nH_440mA_0402  [FP-LQW15AN_80-MFG]
P3  U.FL-R-SMT-1(01)  [HRS-U.FL-R-SMT-3_V]
P4  U.FL-R-SMT-1(01)  [HRS-U.FL-R-SMT-3_V]
R75  0_5%_0402  [RESC1005X40X25NL05T10]
R76  0_5%_0402  [RESC1005X40X25NL05T10]
R77  0_5%_0402  [RESC1005X40X25NL05T10]
R78  0_5%_0402  [RESC1005X40X25NL05T10]
R79  0_5%_0402  [RESC1005X40X25NL05T10]
R80  49.9_1%_0402  [RESC1005X40X25NL10T10]
R84  0_5%_0402  [RESC1005X40X25NL05T10]
R85  49.9_1%_0402  [RESC1005X40X25NL10T10]
R86  59_1%_0402  [RESC1005X40X25LL10T10]
R87  0_5%_0402  [RESC1005X40X25NL05T10]
R93  150_1%_0402  [RESC1005X40X25NL10T10]
R94  DNI_0_5%_0402  [RESC1005X40X25NL05T10]  (no BOM)
R100  100_1%_0402  [RESC1005X40X25NL05T10]
R101  59_1%_0402  [RESC1005X40X25LL10T10]
R102  150_1%_0402  [RESC1005X40X25NL10T10]
R103  10K_1%_0402  [RESC1005X40X25NL10T10]
R104  DNI_10K_1%_0402  [RESC1005X40X25NL10T10]  (no BOM)
R105  10K_1%_0402  [RESC1005X40X25NL10T10]
R106  0_5%_0402  [RESC1005X40X25NL05T10]
R107  10K_1%_0402  [RESC1005X40X25NL10T10]
R108  10K_1%_0402  [RESC1005X40X25NL10T10]
R110  10K_1%_0402  [RESC1005X40X25NL10T10]
R111  4.7K_1%_0402  [RESC1005X40X25NL10T10]
R113  4.7K_1%_0402  [RESC1005X40X25NL10T10]
R114  4.7K_1%_0402  [RESC1005X40X25NL10T10]
R115  10K_1%_0402  [RESC1005X40X25NL10T10]
R116  10K_1%_0402  [RESC1005X40X25NL10T10]
R117  DNI_0_5%_0402  [RESC1005X40X25NL05T10]  (no BOM)
U24  SI5341B-B05071-GM  [QFN64_SI5341_SIL_SKY]
Y3  ABM10-48.000MHZ-E20-T  [FP-ABM10-MFG]

### Nets
+3V3: C39.1 C113.1 C114.1 C115.1 C116.1 C117.1 C118.1 C119.1 L15.1 R103.2 R107.2 R108.2 R110.2 R111.2 R113.2 R114.2 R115.2 R116.2 U24.26(VDDO1) U24.29(VDDO2) U24.33(VDDO3) U24.40(VDDO5) U24.43(VDDO6) U24.49(VDDO7) U24.52(VDDO8) U24.57(VDDO9)
GND: C39.2 C105.1 C106.2 C107.2 C108.2 C109.2 C110.2 C111.2 C112.2 C113.2 C114.2 C115.2 C116.2 C117.2 C118.2 C119.2 C120.2 C121.2 C122.2 C123.2 C124.2 C125.2 C130.2 C133.2 J5.2 J5.3 J5.4 J5.5 J6.2 J6.3 J6.4 J6.5 P3.1 P3.2 P4.1 P4.2 R93.1 R102.1 R104.1 R105.1 U24.65
P1V8: C109.1 C110.1 C111.1 C112.1 C120.1 C121.1 C122.1 C123.1 C124.1 C125.1 U24.22(VDDO0) U24.32(VDD) U24.36(VDDO4) U24.46(VDD) U24.60(VDD)
PLL_VDDA: C107.1 C108.1 L15.2 U24.13(VDDA)
DCTCXO_10MHz: C126.2 R87.1 ; off-sheet DCTCXO_10MHz
ESPMGMT_TCXO_SCL: R111.1 U24.16(SCLK) ; off-sheet ESPMGMT_TCXO_SCL
ESPMGMT_TCXO_SDA: R113.1 U24.18(SDA/SDIO) ; off-sheet ESPMGMT_TCXO_SDA
PLL_A0_CSB: R116.1 U24.19(A0/CSB) ; off-sheet PLL_A0_CSB
PLL_A1_SDO: R115.1 U24.17(A1/SDO) ; off-sheet PLL_A1_SDO
PLL_FB_IN_N: C129.2 R100.2 U24.62(FB_INB) ; off-sheet PLL_FB_IN_N
PLL_FB_IN_P: C128.2 R100.1 U24.61(FB_IN) ; off-sheet PLL_FB_IN_P
PLL_FDEC: U24.25(FDEC) ; off-sheet PLL_FDEC
PLL_FINC: U24.48(FINC) ; off-sheet PLL_FINC
PLL_I2C_SEL: R103.1 R104.2 U24.39(I2C_SEL) ; off-sheet PLL_I2C_SEL
PLL_IN_SEL0: R107.1 U24.3(IN_SEL0) ; off-sheet PLL_IN_SEL0
PLL_IN_SEL1: R108.1 U24.4(IN_SEL1) ; off-sheet PLL_IN_SEL1
PLL_INTRB: R110.1 U24.12(INTRB) ; off-sheet PLL_INTRB
PLL_LOLB: U24.47(LOLB) ; off-sheet PLL_LOLB
PLL_MGMT_CLK_0: R79.2 ; off-sheet PLL_MGMT_CLK_0
PLL_MGMT_CLK_1: R77.2 ; off-sheet PLL_MGMT_CLK_1
PLL_OEB: R105.2 U24.11(OEB) ; off-sheet PLL_OEB
PLL_OUT3_N: C129.1 U24.34(OUT3B) ; off-sheet PLL_OUT3_N
PLL_OUT3_P: C128.1 U24.35(OUT3) ; off-sheet PLL_OUT3_P
PLL_RCB_10M_OUT: R85.1 ; off-sheet PLL_RCB_10M_OUT
PLL_RSTB: R114.1 U24.6(RSTB) ; off-sheet PLL_RSTB
PLL_SMA_10M_IN_C: C132.1 U24.1(IN1) ; off-sheet PLL_SMA_10M_IN_C
PLL_SPARE: P4.3 R75.2 ; off-sheet PLL_SPARE
PLL_SPARE_SMA: J5.1 R76.2 ; off-sheet PLL_SPARE_SMA
PLL_SYNCB: U24.5(SYNCB) ; off-sheet PLL_SYNCB
PLL_UFL_OUT: P3.3 R80.1 ; off-sheet PLL_UFL_OUT
RX_32MHz: R101.2 R102.2 ; off-sheet RX_32MHz
RX_32MHz_PLL: R84.2 R101.1 ; off-sheet RX_32MHz_PLL
TCXO_10M_C: C127.1 U24.63(IN0) ; off-sheet TCXO_10M_C
TX_32MHz: R86.2 R93.2 ; off-sheet TX_32MHz
TX_32MHz_PLL: R78.2 R86.1 ; off-sheet TX_32MHz_PLL
NetC105_2: C105.2 U24.2(IN1B)
NetC106_1: C106.1 U24.64(IN0B)
NetC126_1: C126.1 C127.2 R87.2 R94.2
NetC130_1: C130.1 R94.1
NetC131_1: C131.1 C132.2 R106.2 R117.2
NetC131_2: C131.2 J6.1 R106.1
NetC133_1: C133.1 R117.1
NetR75_1: R75.1 U24.59(OUT9)
NetR76_1: R76.1 U24.51(OUT7)
NetR77_1: R77.1 U24.45(OUT6)
NetR78_1: R78.1 U24.24(OUT0)
NetR79_1: R79.1 U24.42(OUT5)
NetR80_2: R80.2 U24.27(OUT1B)
NetR84_1: R84.1 U24.38(OUT4)
NetR85_2: R85.2 U24.31(OUT2)
NetU24_7: U24.7(X1) Y3.4(GND)
NetU24_8: U24.8(XA) Y3.1
NetU24_9: U24.9(XB) Y3.3
NetU24_10: U24.10(X2) Y3.2(GND)

Not connected (* = marked no-connect by the designer): U24 14(IN2) 15(IN2B) 20(RSVD) 21(RSVD) 23(OUT0B) 28(OUT1) 30(OUT2B) 37(OUT4B) 41(OUT5B) 44(OUT6B) 50(OUT7B) 53(OUT8B) 54(OUT8) 55(RSVD) 56(RSVD) 58(OUT9B)

### Layout directives
differential pair: PLL_FB_IN_N, PLL_FB_IN_P, PLL_OUT3_N, PLL_OUT3_P

### Notes on the sheet
- Newracom 1.2V DC coupled, reserve 0 ohm for AC couple option
- (near R84) Newracom 1.2V DC coupled, reserve 0 ohm for AC couple option
- (near R84) Zero-Delay Feedback
- (near R86) 1.8V to 1.2V resistor divider
- (near R101) 1.8V to 1.2V resistor divider
- Default is I2C
- (near J5) SMA
- (near J6) SMA
- Default is crystal

### Library data of the parts
C39 C105 C106 C108 C110 C112 C113 C115 C117 C119 C121 C123 C125-C133 = CMP-1034-02068-3: as C81 on sheet POWER; ComponentLink2URL: https://content.kemet.com/datasheets/KEM_C1002_X7R_SMD.pdf; Automotive: No; Device Class L2: Capacitors; Temperature: -55°C to +125°C; RoHS: TRUE; Voltage Rating: 16 V; ComponentLink2Description: Datasheet; Device Class L3: Ceramic Capacitors; Temperature Range Low: -55°C; Ipc Land Pattern Name: CAPC10050X50; Device Class L1: Passive Components; Temperature Range High: +125°C; Package: C0402-BB; Capacitance: 0.10 μF; Category: Cap; Mouser Description: CAP CER 0.1UF 16V X7R 0402; Height: 0.55mm; Digikey Description: CAP CER 0.1UF 16V 5% X7R 0402; Octopart: https://octopart.com/c0402c104j4ractu-kemet-12573893; Temperature Characteristic: X7R; Lead Free: Yes
C107 C109 C111 C114 C116 C118 C120 C122 C124 = CMP-14477-000104-2: None; Tolerance: 10%; Voltage Rating: 16V; Dielectric: X5R; Capacitance: 1uF; Packaging: Tape and Reel; Depth: 0.5mm; Mount: Surface Mount; Thickness: 0.022inch; Package Quantity: 1; Min Operating Temperature: -55°C; Series: M; Voltage Rating (DC): 16V; Termination: SMD/SMT; Case/Package: 0402; Number of Pins: 2; Case Code (Imperial): 0402; Length: 1mm; Halogen Free: Halogen Free; Case Code (Metric): 1005; Width: 0.02inch; RoHS Compliant: Yes; Radiation Hardening: No; Max Operating Temperature: 85°C; Height: 0.5mm; Construction: Flat
J5 J6 = CMP-2000-05415-1: SMA Connector, Pitch 5.08 mm, 1 Position, Height 9.5 mm, Tail Length 4 mm, -65 to 165 degC, RoHS, Bulk; Manufacturer: TE Connectivity; Connector Mounting: PCBMount; Connector Body Style: StraightJack; Impedance: 50ohm; Coaxial Termination: Solder; SVHC: NoSVHC(15-Jun-2015); Frequency Max: 3GHz; Product Range: ZDCSeries; Connector Type: SMACoaxial; Datasheet Version: Rev. B1, 03/2011; Package Reference: 5-1814832-1; Package Description: SMA Connector, Pitch 5.08 mm, 1 Position, Height 9.5 mm, Tail Length 4 mm; Contact Plating: GoldPlatedContacts; Coaxial Cable Types: -; Contact Material: BerylliumCopper; Manufacturer URL: http://www.te.com/; Datasheet URL: http://www.onlinecomponents.com/productFiles/mf-AMP/eng_cd_1814832_a.pdf
L15 = CMP-06042-005115-1: Wire Wound RF Inductor 47nH ±5% 440mA 0.648Ω 0402 (1005); Shielding: Unshielded; Core Material: Non-Magnetic; Test Frequency: 100MHz; Q Factor: 25; DC Resistance (DCR): 648mR; Self Resonant Frequency: 3.2GHz; Width: 0.024inch; Packaging: Tape and Reel; Mount: Surface Mount; Resistor Type: Wirewound; Termination: SMD/SMT; Tolerance: 5%; Case Code (Metric): 1005; Min Operating Temperature: -55°C; Current Rating: 440mA; Height: 0.5mm; Max Operating Temperature: 125°C; Case/Package: 0402; Height - Seated (Max): 0.024inch; Length: 0.039inch; Inductance: 47nH; Case Code (Imperial): 0402; Max DC Current: 440mA; Package Quantity: 1
P3 P4 = CMP-2000-05153-1: Ultra Small Coaxial Connector, 6 GHz, -40 to 90 degC, 3-Pin SMD, RoHS, Bulk; Manufacturer: Hirose Electric; Connector Style: U.FL; Impedance: 50Ohm; Dielectric Material: LiquidCrystalPolymer(LCP); Minimum Quantity: UltraMiniatureCoaxial; Online Catalog: U.FLSeries; Featured Product: HiroseU.FLSeries; Frequency - Max: 6GHz; Other Names: H122041 / U.FL-R-SMT-1(01)-ND; Contact Termination: Solder; Body Material: PhosphorBronze; Connector Type: Jack,MalePin; Body Finish: Silver; Center Contact Plating: Gold; Manufacturer URL: https://www.hirose.com; Family: CoaxialConnectors(RF); Fastening Type: Snap-On; Unit PriceUSD: U.FL; Series: U.FL; Package Reference: U.FL-R-SMT; Packaging: Bulk; Standard Package: 100; Mounting Type: SurfaceMount; Quantity Available: Bulk; Housing Color: Silver; Package Description: 3-Pin Surface Mount Device, Body 2.6 x 2.6 mm; Category: Connectors,Interconnects; Operating Temperature: -40degC~90degC; Center Contact Material: PhosphorBronze; Dynamic Catalog: U.FLSeries; Datasheet URL: https://datasheet.ciiva.com/26945/getdatasheetpartid-475239-26945414.pdf; Datasheet Version: Feb-09; Shield Termination: Solder
R75-R79 R84 R87 R94 R106 R117 = CMP-2002-06457-1: as R121 on sheet POWER
R80 R85 = CMP-2002-04448-1: Part Number: RK73H1ETTP49R9F; Manufacturer: KOA Speer
R86 R101 = CMP-1011-00371-2: Part Number: CR0402-FX-59R0GLF; Manufacturer: Bourns
R93 R102 = CMP-2002-05949-1: Part Number: MC00625W04021150R; Manufacturer: Multicomp
R100 = CMP-2002-07853-1: Manufacturer: Yageo; Part Number: RC0402FR-13100RL
R103-R105 R107 R108 R110 R115 R116 = CMP-2002-04694-1: as R73 on sheet POWER
R111 R113 R114 = CMP-2002-05217-1: Manufacturer: Bourns; Part Number: CR0402-FX-4701GLF
U24 = SI5341B-B05071-GM: No Description Available; Mfr_Name: Skyworks; Type: DEV; Copyright: Copyright (C) 2023 Ultra Librarian. All rights reserved.; Manufacturer_Part_Number: SI5341B-B05071-GM; RefDes: RefDes
Y3 = CMP-27762-011866-1: Crystal 48MHz ±20ppm 10pF SMD-4 2.5mm x 2mm; ESR (Equivalent Series Resistance): 70R; Frequency Tolerance: 20ppm; Depth: 2mm; Height: 0.02inch; RoHS Compliant: Yes; Lead Free: Lead Free; Case/Package: CSMD; Tolerance: 20ppm; Operating Frequency: 48 MHz; Load Capacitance: 10pF; Package Quantity: 1000; Mount: Surface Mount; Number of Pins: 4; Frequency: 48MHz; Length: 2.5mm; Series Resistance: 70R; Packaging: Tape and Reel; Min Operating Temperature: -20°C; Max Operating Temperature: 70°C; Termination: SMD/SMT; Width: 0.079inch; Frequency Stability: 20ppm; Series: ABM10

## Nets that join several sheets
+3V3: NRC7394-TX (31 pins), NRC7394-RX (31 pins), RF PATH (10 pins), POWER (10 pins), DCTCXO (6 pins), PLL (26 pins)
+5V: NRC7394-TX (C16.2 C17.2 R8.1 U3.4), NRC7394-RX (C56.2 C57.2 R47.1 U11.4), PROGRAMMING (C63.2 U17.11), POWER (14 pins)
GND: NRC7394-TX (58 pins), NRC7394-RX (58 pins), RF PATH (48 pins), PROGRAMMING (8 pins), POWER (33 pins), DCTCXO (9 pins), PLL (41 pins)
P1V8: POWER (C101.1 C102.1 U23.5), PLL (15 pins)
DCTCXO_10MHz: DCTCXO (X5.6), PLL (C126.2 R87.1)
ESPMGMT_TCXO_SCL: DCTCXO (R112.1), PLL (R111.1 U24.16)
ESPMGMT_TCXO_SDA: DCTCXO (R109.1), PLL (R113.1 U24.18)
RX_32MHz: NRC7394-RX (U9.15), PLL (R101.2 R102.2)
RX_GP16: NRC7394-RX (U9.21), RF PATH (R72.2 U21.17)
RX_GP18: NRC7394-RX (U9.19), RF PATH (R70.2 U21.16)
RX_RFIO: NRC7394-RX (C88.2 L14.2), RF PATH (C98.1)
RX_USB_D_N: NRC7394-RX (U11.1), PROGRAMMING (U17.1)
RX_USB_D_P: NRC7394-RX (U11.12), PROGRAMMING (U17.2)
TX_32MHz: NRC7394-TX (U1.15), PLL (R86.2 R93.2)
TX_GP16: NRC7394-TX (U1.21), RF PATH (R89.2 U13.17)
TX_GP18: NRC7394-TX (U1.19), RF PATH (R88.2 U13.16)
TX_RFIO: NRC7394-TX (C31.2 L8.2), RF PATH (C103.1)
TX_USB_D_N: NRC7394-TX (U3.1), PROGRAMMING (U17.3)
TX_USB_D_P: NRC7394-TX (U3.12), PROGRAMMING (U17.4)
USB_D_N: PROGRAMMING (U17.9), POWER (J11.A7 J11.B7 U20.3)
USB_D_P: PROGRAMMING (U17.10), POWER (J11.A6 J11.B6 U20.1)